# EAGLE design Gauge (EAGLE 7.5.0)
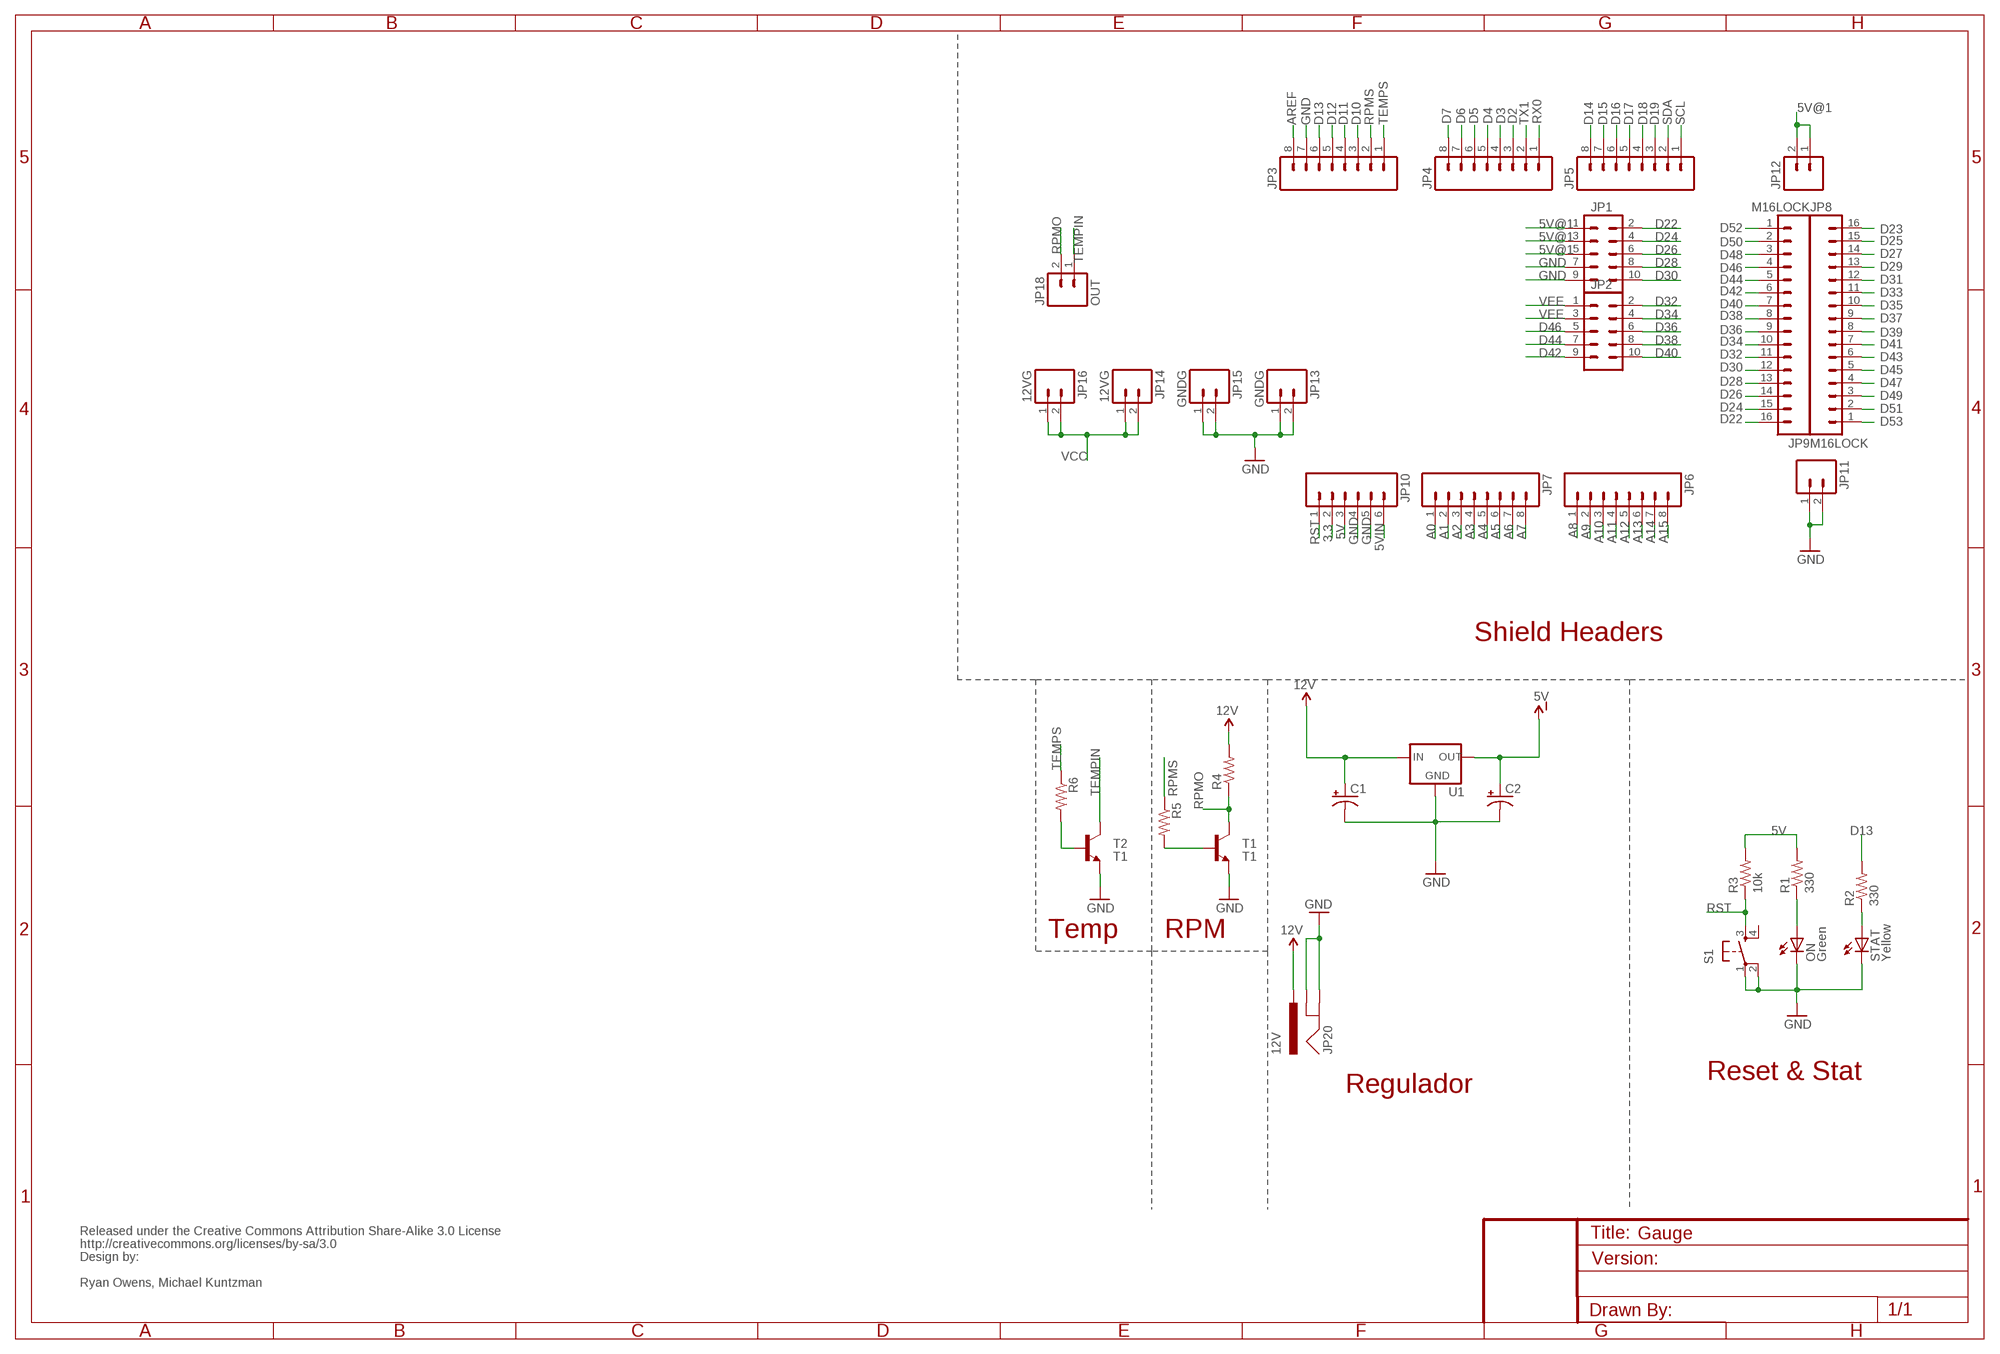
[diagram p0: schematic, sheet 1]

## Parts
C1  100UF-25V-20%(PTH)  [CPOL-RADIAL-100UF-25V]
C2  100UF-25V-20%(PTH)  [CPOL-RADIAL-100UF-25V]
JP1  M05X2PTH  [AVR_ICSP]
JP2  M05X2PTH  [AVR_ICSP]
JP3  M08LOCK  [1X08_LOCK]
JP4  M08LOCK  [1X08_LOCK]
JP5  M08LOCK  [1X08_LOCK]
JP6  M08LOCK  [1X08_LOCK]
JP7  M08LOCK  [1X08_LOCK]
JP8  M16LOCK  [1X16_LOCK]
JP9  M16LOCK  [1X16_LOCK]
JP10  M06LOCK  [1X06_LOCK]
JP11  M02LOCK  [1X02_LOCK]
JP12  M02LOCK  [1X02_LOCK]
JP13  GNDG  M02POLAR  [MOLEX-1X2]
JP14  12VG  M02POLAR  [MOLEX-1X2]
JP15  GNDG  M02POLAR  [MOLEX-1X2]
JP16  12VG  M02POLAR  [MOLEX-1X2]
JP18  OUT  M02POLAR  [MOLEX-1X2]
JP20  12V  POWER_JACKPTH_LOCK  [POWER_JACK_PTH_LOCK]
ON  Green  LED0603  [LED-0603]
R1  330  RESISTOR0603-RES  [0603-RES]
R2  330  RESISTOR0603-RES  [0603-RES]
R3  10k  RESISTOR0603-RES  [0603-RES]
R4  RESISTORPTH-1/2W  [AXIAL-0.5]
R5  RESISTORPTH-1/2W  [AXIAL-0.5]
R6  RESISTORPTH-1/2W  [AXIAL-0.5]
S1  TAC_SWITCHSMD  [TACTILE_SWITCH_SMD]
STAT  Yellow  LED0603  [LED-0603]
T1  T1  TRANSISTOR_NPN_2PTH  [TO-92]
T2  T1  TRANSISTOR_NPN_2PTH  [TO-92]
U1  V_REG_78XX-TO-220  [TO-220-ALT]
U$2  CREATIVE_COMMONS  [CREATIVE_COMMONS]

## Nets
3.3: JP10.2
5V: JP10.3 R1.2 R3.2
5V@1: JP1.1 JP1.3 JP1.5 JP12.1 JP12.2
5VIN: C2.1(+) JP10.6 U1.OUT ; supply symbol labelled 5V
A0: JP7.1
A1: JP7.2
A2: JP7.3
A3: JP7.4
A4: JP7.5
A5: JP7.6
A6: JP7.7
A7: JP7.8
A8: JP6.1
A9: JP6.2
A10: JP6.3
A11: JP6.4
A12: JP6.5
A13: JP6.6
A14: JP6.7
A15: JP6.8
AREF: JP3.8
D2: JP4.3
D3: JP4.4
D4: JP4.5
D5: JP4.6
D6: JP4.7
D7: JP4.8
D10: JP3.3
D11: JP3.4
D12: JP3.5
D13: JP3.6 R2.2
D14: JP5.8
D15: JP5.7
D16: JP5.6
D17: JP5.5
D18: JP5.4
D19: JP5.3
D22: JP1.2 JP9.16
D23: JP8.16
D24: JP1.4 JP9.15
D25: JP8.15
D26: JP1.6 JP9.14
D27: JP8.14
D28: JP1.8 JP9.13
D29: JP8.13
D30: JP1.10 JP9.12
D31: JP8.12
D32: JP2.2 JP9.11
D33: JP8.11
D34: JP2.4 JP9.10
D35: JP8.10
D36: JP2.6 JP9.9
D37: JP8.9
D38: JP2.8 JP9.8
D39: JP8.8
D40: JP2.10 JP9.7
D41: JP8.7
D42: JP2.9 JP9.6
D43: JP8.6
D44: JP2.7 JP9.5
D45: JP8.5
D46: JP2.5 JP9.4
D47: JP8.4
D48: JP9.3
D49: JP8.3
D50: JP9.2
D51: JP8.2
D52: JP9.1
D53: JP8.1
GND: C1.2(-) C2.2(-) JP1.7 JP1.9 JP3.7 JP10.4 JP10.5 JP11.1 JP11.2 JP13.1 JP13.2 JP15.1 JP15.2 JP20.GND JP20.GNDBREAK ON.C S1.1 S1.2 STAT.C T1.3(E) T2.3(E) U1.GND
N$1: R5.P$2 T1.2(B)
N$2: R6.P$2 T2.2(B)
N$126: ON.A R1.1
N$127: R2.1 STAT.A
RPMO: JP18.2 R4.P$1 T1.1(C)
RPMS: JP3.2 R5.P$1
RST: JP10.1 R3.1 S1.3
RX0: JP4.1
SCL: JP5.1
SDA: JP5.2
TEMPIN: JP18.1 T2.1(C)
TEMPS: JP3.1 R6.P$1
TX1: JP4.2
VCC: C1.1(+) JP14.1 JP14.2 JP16.1 JP16.2 JP20.PWR U1.IN ; supply symbol labelled 12V
VEE: JP2.1 JP2.3
VNEG: R4.P$2 ; supply symbol labelled 12V
Unconnected: S1.4

## Notes on the sheet
- Shield Headers
- Temp | RPM
- Reset & Stat
- Regulador
- Ryan Owens, Michael Kuntzman

## Library data of the parts
C1 C2 = SparkFun-Capacitors:100UF-25V-20%(PTH): CAP-08439; PROD_ID: CAP-08439
JP1 JP2 = SparkFun-Connectors:M05X2: Header 5x2 Standard 10-pin dual row 0.1" header. Commonly used with AVR-ISP. Use with Spark Fun Electronics SKU: PRT-00778
JP3-JP7 = SparkFun:M08: Header 8 Standard 8-pin 0.1" header. Use with straight break away headers (SKU : PRT-00116), right angle break away headers (PRT-00553), swiss pins (PRT-00743), machine pins (PRT-00117), and female headers (PRT-00115).
JP8 JP9 = SparkFun:M16
JP10 = SparkFun:M06: Header 6 Standard 6-pin 0.1" header. Use with straight break away headers (SKU : PRT-00116), right angle break away headers (PRT-00553), swiss pins (PRT-00743), machine pins (PRT-00117), and female headers (PRT-00115). Molex polarized connector foot print use with SKU : PRT-08094 with associated crimp pins and housings. NOTES ON THE VARIANTS LOCK and LOCK_LONGPADS... This footprint was designed to help hold the alignment of a through-hole component (i.e. 6-pin header) while soldering it into place. You may notice that each hole has been shifted either up or down by 0.005 of an inch from it's more standard position (which is a perfectly straight line). This slight alteration caused the pins (the squares in the middle) to touch the edges of the holes. Because they are alternating, it causes a "brace" to hold the component in place. 0.005 has proven to be the perfect amount of "off-center" position when using our standard breakaway headers. Although looks a little odd when you look at the bare footprint, once you have a header in there, the alteration is very hard to notice. Also, if you push a header all the way into place, it is covered up entirely on the bottom side. This idea of altering the position of holes to aid alignment will be further integrated into the Sparkfun Library for other footprints. It can help hold any component with 3 or more connection pins.
JP11 JP12 = SparkFun:M02: Header 2 Standard 2-pin 0.1" header. Use with straight break away headers (SKU : PRT-00116), right angle break away headers (PRT-00553), swiss pins (PRT-00743), machine pins (PRT-00117), and female headers (PRT-00115). Molex polarized connector foot print use with SKU : PRT-08233 with associated crimp pins and housings.
JP13-JP16 JP18 = SparkFun-Connectors:M02: Standard 2-pin 0.1" header. Use with - straight break away headers ( PRT-00116) - right angle break away headers (PRT-00553) - swiss pins (PRT-00743) - machine pins (PRT-00117) - female headers (PRT-00115) Molex polarized connector foot print use with: PRT-08233 with associated crimp pins and housings. 2.54_SCREWTERM for use with PRT-10571. 3.5mm Screw Terminal footprints for PRT-08084 5mm Screw Terminal footprints for use with PRT-08432
JP20 = SparkFun-Connectors:POWER_JACK: Power Jack This is the standard 5.5mm barrel jack for power. The PTH is the most common, proven, reliable, footprint. The Slot footprint only works if the mill layer is transmitted to the PCB fab house so be warned. Mating wall wart : TOL-00298 (and others); PROD_ID: CONN-08197; SF_ID: PRT-00119
ON STAT = SparkFun:LED: LEDs Standard schematic elements and footprints for 5mm, 3mm, 1206, and 0603 sized LEDs. 5mm - Spark Fun Electronics SKU : COM-00529 (and others)
R1-R3 = SparkFun:RESISTOR: Resistor
R4-R6 = SparkFun-Passives:RESISTOR: Resistor
S1 = SparkFun:TAC_SWITCH: Momentary Switch Button commonly used for reset or general input. Spark Fun Electronics SKU : COM-00097
T1 T2 = SparkFun-DiscreteSemi:TRANSISTOR_NPN_2: Alternate TO-92 NPN BJT
U1 = SparkFun-PowerIC:V_REG_78XX: Voltage Regulator Standard 78xx regulator. IGO (Input Ground Output). Spark Fun Electronics SKU : COM-00107; PROD_ID: VREG-08450; SF_ID: COM-00107
U$2 = SparkFun:CREATIVE_COMMONS

## Board
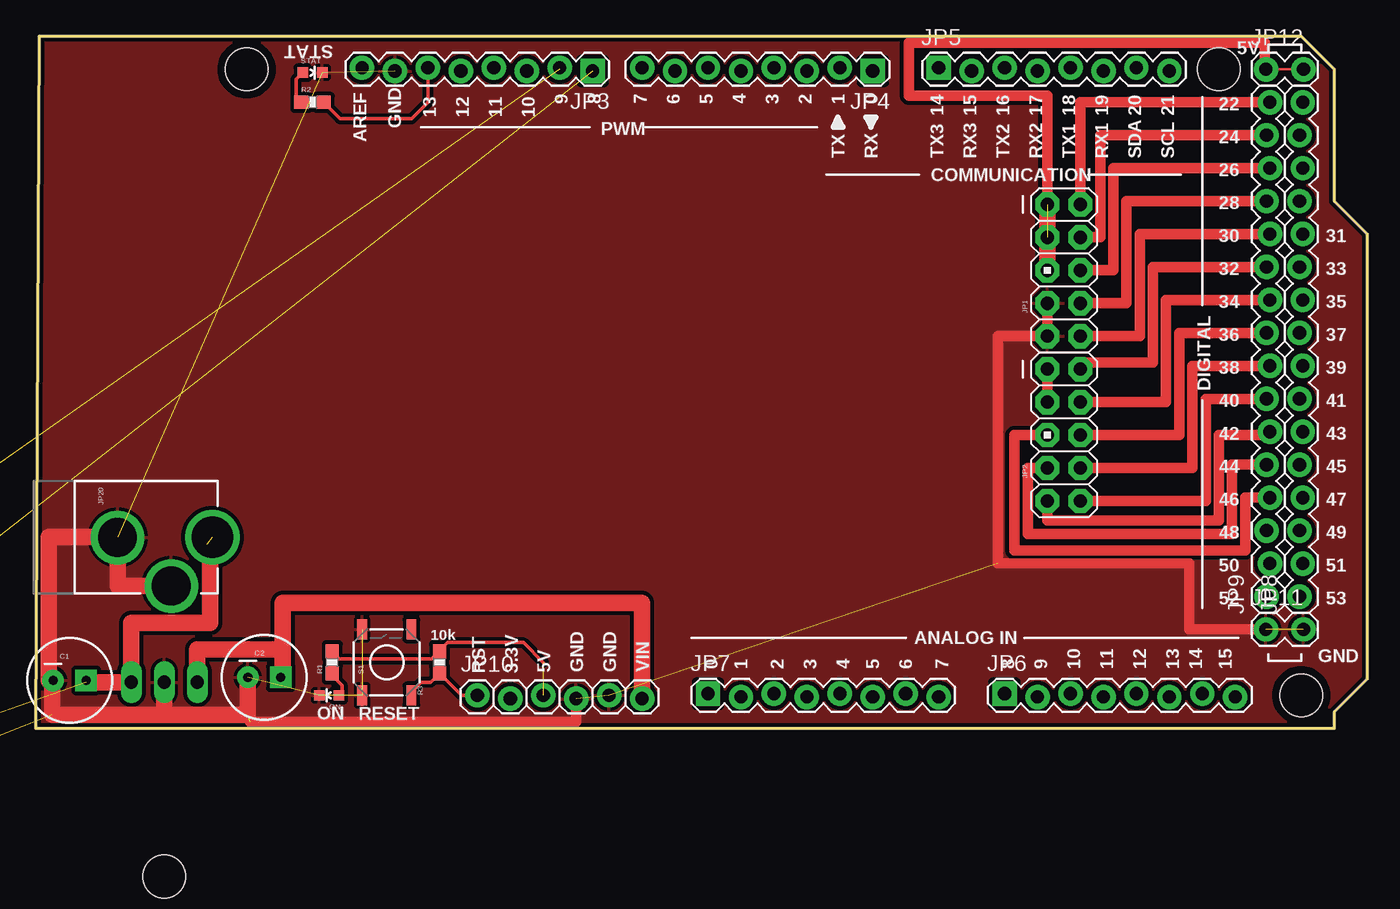
[diagram p1: board, top side]
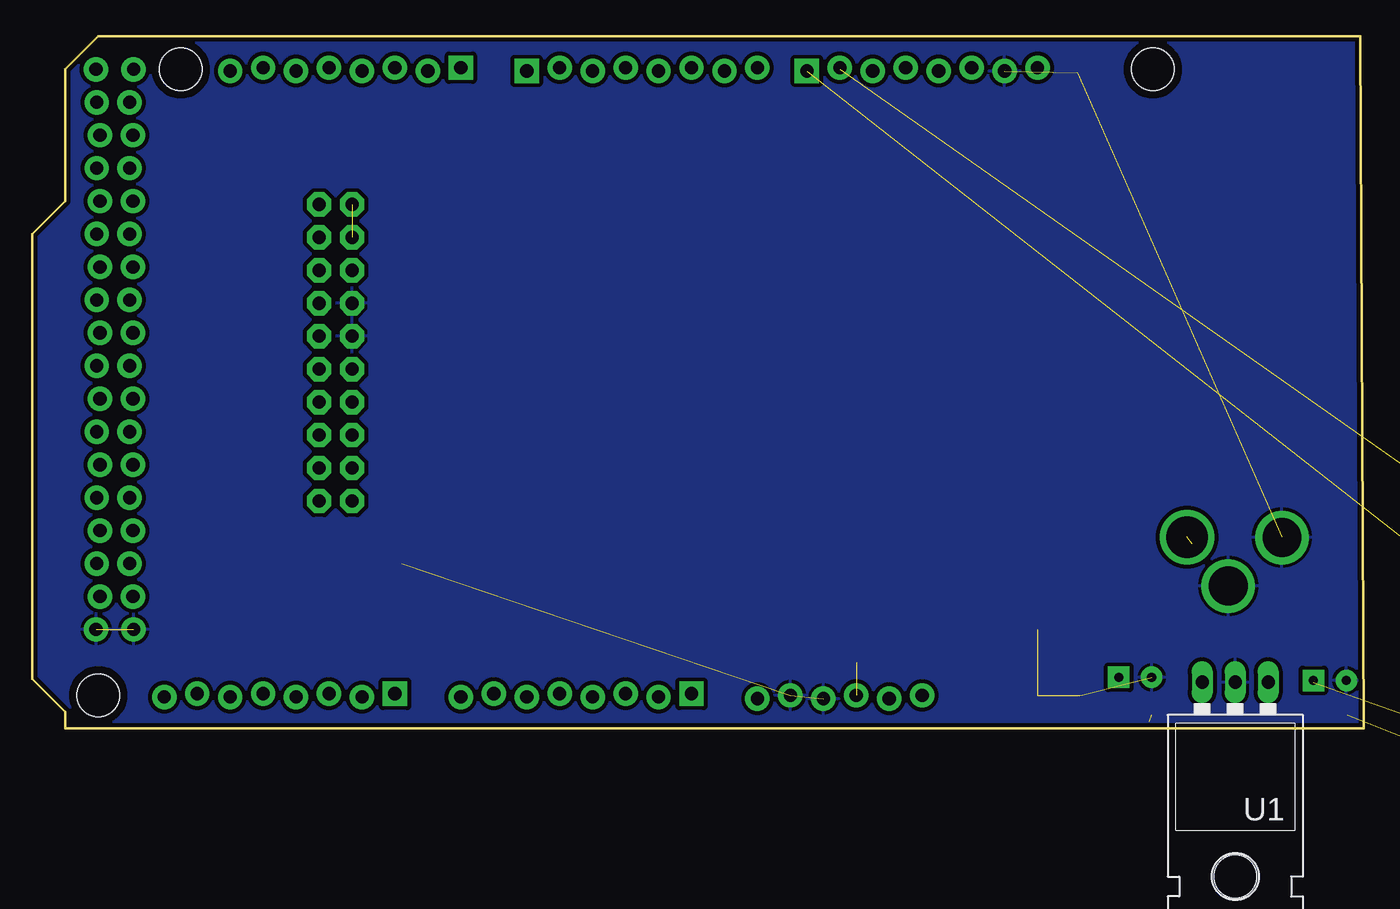
[diagram p2: board, bottom side, seen from below]

Size 102.62 x 53.34 mm. Coordinates in mm from the lower left corner, seen from the top.
Outline: 0,0 100.08,0 100.08,1.27 102.62,3.81 102.62,38.1 100.08,40.64 100.08,50.8 97.54,53.34 0.25,53.34 0,0
Copper layers (1*16): Top 0.035mm / dielectric 1.5mm / Bottom 0.035mm
Design rules "SparkFun": minimum track width 8mil, minimum drill 20mil, track to track 8mil, track to pad 8mil, pad to pad 8mil, via to via 8mil, smd to smd 8mil, copper to edge 10mil, drill to drill 8mil, minimum pad ring 12mil, minimum via ring 10mil, stop-mask expansion 4mil, vias tented up to drill 25mil, thermal gap 10mil

### Footprints (pad centres in the part's own frame; a part is rotated, then mirrored left to right if it is on the bottom)
CPOL-RADIAL-100UF-25V = drill 0.7 pad 1.651 square: 1 1.27,0 | drill 0.7 pad 1.651: 2 -1.27,0
AVR_ICSP = drill 1.016 pad 1.88 octagon: 1 -1.27,5.08; 2 1.27,5.08; 3 -1.27,2.54; 4 1.27,2.54; 5 -1.27,0; 6 1.27,0; 7 -1.27,-2.54; 8 1.27,-2.54; 9 -1.27,-5.08; 10 1.27,-5.08
1X08_LOCK = drill 1.016 pad 1.88 square: 1 0,0.127 | drill 1.016 pad 1.88: 2 2.54,-0.127; 3 5.08,0.127; 4 7.62,-0.127; 5 10.16,0.127; 6 12.7,-0.127; 7 15.24,0.127; 8 17.78,-0.127
1X16_LOCK = drill 1.016 pad 1.88: 1 0,0.127; 2 2.54,-0.127; 3 5.08,0.127; 4 7.62,-0.127; 5 10.16,0.127; 6 12.7,-0.127; 7 15.24,0.127; 8 17.78,-0.127; 9 20.32,0.127; 10 22.86,-0.127; 11 25.4,0.127; 12 27.94,-0.127; 13 30.48,0.127; 14 33.02,-0.127; 15 35.56,0.127; 16 38.1,-0.127
1X06_LOCK = drill 1.016 pad 1.88: 1 0,0; 2 2.54,-0.254; 3 5.08,0; 4 7.62,-0.254; 5 10.16,0; 6 12.7,-0.254
1X02_LOCK = drill 1.016 pad 1.88: 1 -0.178,0; 2 2.718,0
MOLEX-1X2 = drill 1.016 pad 1.88 square: 1 0,0 | drill 1.016 pad 1.88: 2 2.54,0
POWER_JACK_PTH_LOCK = drill 2.997 pad 4.115: GND 0.025,6.557; GNDBREAK 3.762,10.7 | drill 3.2 pad 4.115: PWR 0,13.878
LED-0603 = smd 0.8 x 0.8: A 0,-0.75; C 0,0.75
0603-RES = smd 1.1 x 1: 1 -0.85,0; 2 0.85,0
AXIAL-0.5 = drill 0.9 pad 1.88: P$1 -6.35,0; P$2 6.35,0
TACTILE_SWITCH_SMD = smd 1.524 x 0.762: 1 -2.54,1.905; 2 2.54,1.905; 3 -2.54,-1.905; 4 2.54,-1.905
TO-92 = drill 0.813 pad 1.88: 1 -1.27,0; 2 0,1.905; 3 1.27,0
TO-220-ALT = drill 1.016 long: GND 0,-3.81; IN -2.54,-3.81; OUT 2.54,-3.81 | hole 3.302: 0,11.176
STAND-OFF = hole 3.302: 0,0

### Placement (x,y rotation side)
C1  2.61,3.68 0 top
C2  17.62,3.94 0 top
JP1  79.25,35.31 0 top
JP2  79.25,22.61 0 top
JP3  42.93,50.8 180 top
JP4  64.52,50.8 180 top
JP5  69.6,50.8 0 top
JP6  74.68,2.54 0 top
JP7  51.82,2.54 0 top
JP8  97.54,10.16 90 top
JP9  95,10.16 90 top
JP10  34.04,2.54 0 top
JP11  95,7.62 0 top
JP12  95,50.8 0 top
JP13  -16.76,-5.08 0 top  (outside the outline)
JP14  -23.11,-5.08 0 top  (outside the outline)
JP15  -29.46,-5.08 0 top  (outside the outline)
JP16  -35.81,-5.08 0 top  (outside the outline)
JP18  -48.51,-5.08 0 top  (outside the outline)
JP20  -0.25,14.73 270 top
ON  22.61,2.54 90 top
R1  22.86,5.08 90 top
R2  21.34,48.26 0 top
R3  31.12,5.08 90 top
R4  -68.83,-24.13 0 top  (outside the outline)
R5  -68.83,-30.48 0 top  (outside the outline)
R6  -68.83,-41.91 0 top  (outside the outline)
S1  27.05,5.08 90 top
STAT  21.34,50.55 270 top
T1  -73.91,-17.78 0 top  (outside the outline)
T2  -73.91,-35.56 0 top  (outside the outline)
U1  9.91,-0.25 180 bottom
U$2  21.34,-7.62 0 top  (outside the outline)
U$3  [STAND-OFF]  16.26,50.8 0 top
U$4  [STAND-OFF]  91.19,50.8 0 top
U$5  [STAND-OFF]  97.54,2.54 0 top

### Tracks (layer width: path | path; a pad name or v marks a point on that pad's centre or on a via)
3.3
  Top 0.203: JP10.2 36.58,2.54
5V  (1 unrouted)
  Top 0.254: 39.12,5.08 37.59,6.6 31.75,6.6 31.12,5.97 R3.2 30.52,5.33 23.37,5.33 22.86,5.84 R1.2
5V@1  (1 unrouted)
  Top 0.203: JP12.1 JP12.2
  Top 0.813: JP1.1 77.98,48.77 67.31,48.77 67.31,52.83 94.74,52.83 94.74,50.8 JP12.1
  Top 1.27: JP1.5 JP1.1
5VIN
  Top 1.27: U1.OUT 12.45,6.1 19.05,6.1 | 19.05,6.1 19.05,3.94 C2.1 | 19.05,6.1 19.05,9.65 46.74,9.65 JP10.6
A0
  Top 0.203: JP7.1 51.82,2.54
A1
  Top 0.203: JP7.2 54.36,2.54
A2
  Top 0.203: JP7.3 56.9,2.54
A3
  Top 0.203: JP7.4 59.44,2.54
A4
  Top 0.203: JP7.5 61.98,2.54
A5
  Top 0.203: JP7.6 64.52,2.54
A6
  Top 0.203: JP7.7 67.06,2.54
A7
  Top 0.203: JP7.8 69.6,2.54
A8
  Top 0.203: JP6.1 74.68,2.54
A9
  Top 0.203: JP6.2 77.22,2.54
A10
  Top 0.203: JP6.3 79.76,2.54
A11
  Top 0.203: JP6.4 82.3,2.54
A12
  Top 0.203: JP6.5 84.84,2.54
A13
  Top 0.203: JP6.6 87.38,2.54
A14
  Top 0.203: JP6.7 89.92,2.54
A15
  Top 0.203: JP6.8 92.46,2.54
AREF
  Top 0.203: JP3.8 25.15,50.8
D2
  Top 0.203: JP4.3 59.44,50.8
D3
  Top 0.203: JP4.4 56.9,50.8
D4
  Top 0.203: JP4.5 54.36,50.8
D5
  Top 0.203: JP4.6 51.82,50.8
D6
  Top 0.203: JP4.7 49.28,50.8
D7
  Top 0.203: JP4.8 46.74,50.8
D10
  Top 0.203: JP3.3 37.85,50.8
D11
  Top 0.203: JP3.4 35.31,50.8
D12
  Top 0.203: JP3.5 32.77,50.8
D13
  Top 0.254: JP3.6 30.23,48.26 28.96,46.99 23.46,46.99 R2.2
D14
  Top 0.203: JP5.8 87.38,50.8
D15
  Top 0.203: JP5.7 84.84,50.8
D16
  Top 0.203: JP5.6 82.3,50.8
D17
  Top 0.203: JP5.5 79.76,50.8
D18
  Top 0.203: JP5.4 77.22,50.8
D19
  Top 0.203: JP5.3 74.68,50.8
D22
  Top 0.813: JP1.2 80.52,48.26 JP9.16
D24
  Top 0.813: JP1.4 82.04,37.85 82.04,45.72 JP9.15
D26
  Top 0.813: JP9.14 83.06,43.18 83.06,35.31 JP1.6
D28
  Top 0.813: JP1.8 84.07,32.77 84.07,40.64 JP9.13
D30
  Top 0.813: JP1.10 85.09,30.23 85.09,38.1 JP9.12
D32
  Top 0.813: JP2.2 80.52,28.19 86.11,28.19 86.11,35.56 JP9.11
D34
  Top 0.813: JP2.4 87.12,25.15 87.12,33.02 JP9.10
D36
  Top 0.813: JP9.9 88.14,30.48 88.14,22.61 JP2.6
D38
  Top 0.813: JP2.8 89.15,20.07 89.15,27.94 JP9.8
D40
  Top 0.813: JP2.10 90.17,17.53 90.17,25.4 JP9.7
D42
  Top 0.813: JP9.6 95.12,22.61 91.19,22.61 91.19,16 77.98,16 JP2.9
D44
  Top 0.813: JP2.7 76.45,20.07 76.45,14.99 92.2,14.99 92.2,20.32 JP9.5
D46
  Top 0.813: JP9.4 93.22,17.78 93.22,13.72 75.44,13.72 75.44,22.61 JP2.5
GND  (15 unrouted)
  Top 0.813: JP10.4 41.66,0.51 16.51,0.51 | JP1.7 JP1.9 74.17,30.23 74.17,12.7 88.9,12.7 88.9,7.62 JP11.1
  Top 1.27: C1.2 1.02,3.68 1.02,14.73 6.3,14.73 JP20.GND 6.3,10.97 JP20.GNDBREAK | C1.2 1.34,3.56 1.27,3.56 | C2.2 16.35,1.02 9.91,1.02 | 9.91,1.02 1.27,1.02 1.27,3.68 C1.2 | U1.GND 9.91,1.02
  pour Bottom (isolate 0.305): 0,0 100.08,0 100.08,1.27 102.62,3.81 102.62,38.1 100.08,40.64 100.08,50.8 97.54,53.34 0.25,53.34 0,2.54
  pour Top (isolate 0.305): 0,0 100.08,0 100.08,1.27 102.62,3.81 102.62,38.1 100.08,40.64 100.08,50.8 97.54,53.34 0.25,53.34
N$1  (1 unrouted)
N$2  (1 unrouted)
N$126
  Top 0.254: R1.1 22.86,4.06 23.62,3.3 23.62,2.81 ON.A
N$127
  Top 0.254: STAT.A 20.07,50.03 20.07,48.26 R2.1
RPMO  (2 unrouted)
RPMS  (1 unrouted)
  Top 0.203: JP3.2 40.39,50.8
RST
  Top 0.254: JP10.1 32.8,2.54 R3.1 30.44,3.56 29.72,3.56 28.96,2.79 S1.3
RX0
  Top 0.203: JP4.1 64.52,50.8
SCL
  Top 0.203: JP5.1 69.6,50.8
SDA
  Top 0.203: JP5.2 72.14,50.8
TEMPIN  (1 unrouted)
TEMPS  (1 unrouted)
  Top 0.203: JP3.1 42.93,50.8
TX1
  Top 0.203: JP4.2 61.98,50.8
VCC  (5 unrouted)
  Top 1.27: C1.1 3.88,3.56 U1.IN 7.37,8.13 13.46,8.13 13.46,14.22 13.21,14.22
VEE
  Top 0.813: JP2.1 JP2.3

### Text on the board
tPlace: STAT | 5V | 9 | 8 | 7 | 6 | 5 | 4 | 3 | 2 | 1 | 0 | 22 | 13 | 12 | 11 | 10 | 14 | 15 | 16 | 17 | 18 | 19 | 20 | 21 | GND | PWM | AREF | 24 | TX | RX | TX3 | RX3 | TX2 | RX2 | TX1 | RX1 | SDA | SCL | 26 | COMMUNICATION | 28 | 30 | 31 | 32 | 33 | 34 | 35 | 36 | 37 | 38 | 39 | DIGITAL | 40 | 41 | 42 | 43 | 44 | 45 | 46 | 47 | 48 | 49 | 50 | 51 | 52 | 53 | ANALOG IN | 0 | 1 | 2 | 3 | 4 | 5 | 6 | 7 | 8 | 9 | 10 | 11 | 12 | 13 | 14 | 15 | GND | RST | 3.3V | 5V | GND | GND | VIN | ON | RESET